# EAGLE schematic Memory (EAGLE 9.6.2)
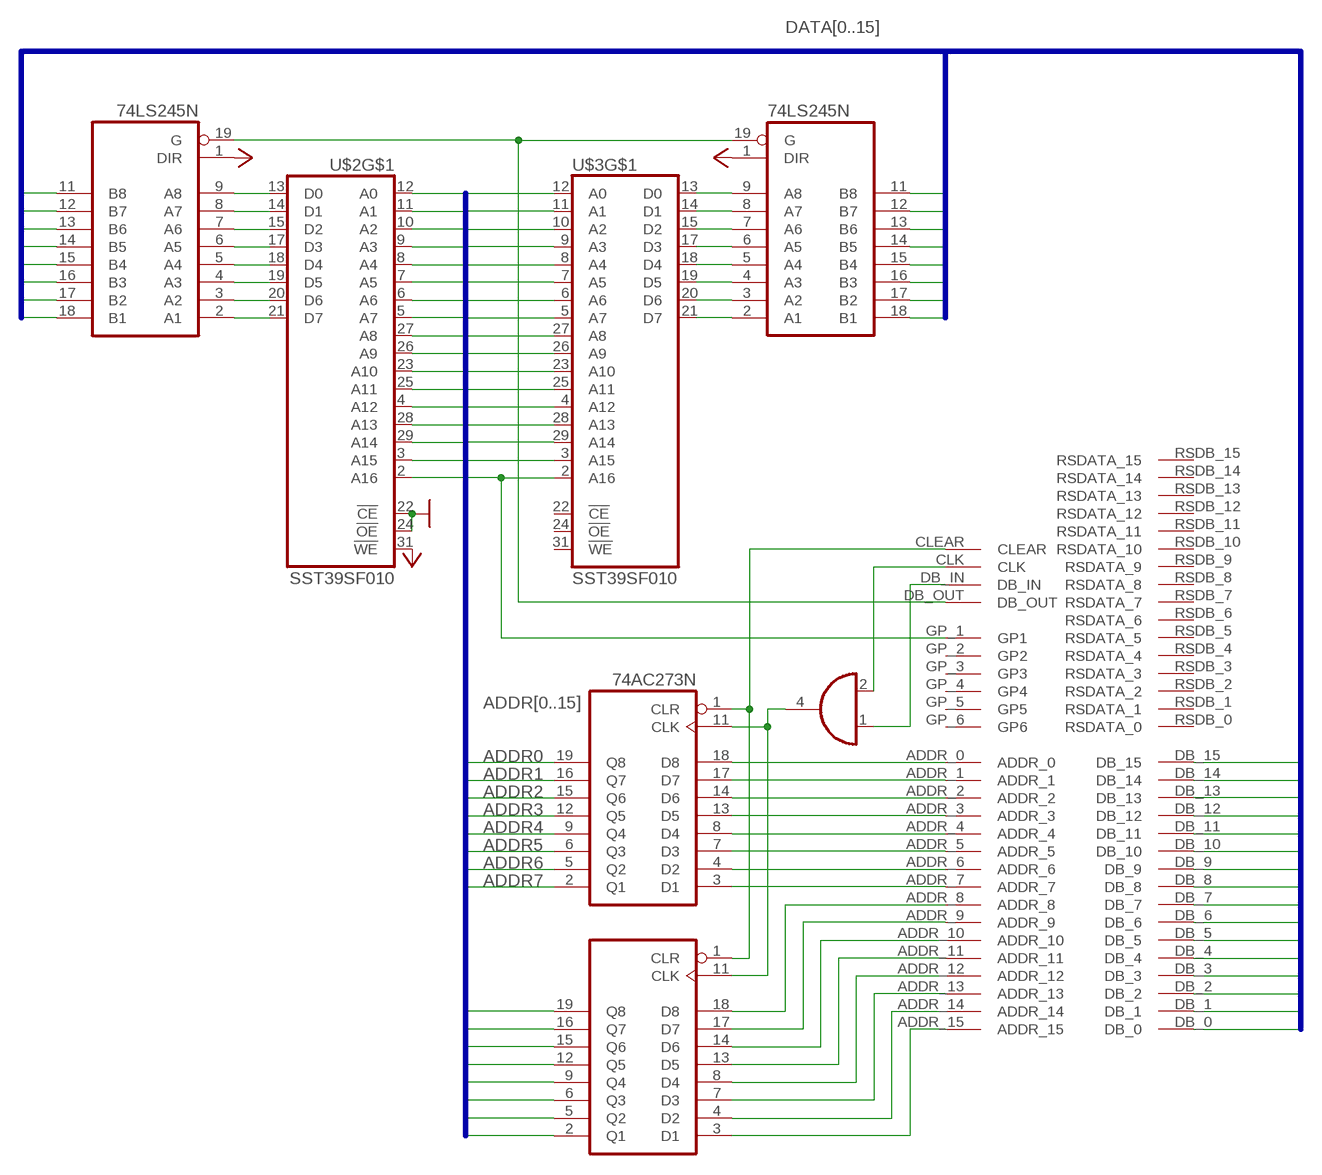
[diagram p0: schematic, sheet 1]

## Parts
IC1  74AC273N  [DIL20]
IC2  74AC273N  [DIL20]
IC4  74AHC1G08DCK  [SC70-5]
OUTPUT_BUFFER_MEMORY  74LS245N  [DIL20]
OUTPUT_BUFFER_MEMORY1  74LS245N  [DIL20]
U$1  BACKPLATE_INTERFACE  [BACK_INTERFACE-FOOT]
U$2  SST39SF010  [DIP32-WIDE]
U$3  SST39SF010  [DIP32-WIDE]

## Nets
ADDR0: IC1.19(Q8) U$2.12(A0) U$3.12(A0)
ADDR1: IC1.16(Q7) U$2.11(A1) U$3.11(A1)
ADDR2: IC1.15(Q6) U$2.10(A2) U$3.10(A2)
ADDR3: IC1.12(Q5) U$2.9(A3) U$3.9(A3)
ADDR4: IC1.9(Q4) U$2.8(A4) U$3.8(A4)
ADDR5: IC1.6(Q3) U$2.7(A5) U$3.7(A5)
ADDR6: IC1.5(Q2) U$2.6(A6) U$3.6(A6)
ADDR7: IC1.2(Q1) U$2.5(A7) U$3.5(A7)
ADDR8: IC2.19(Q8) U$2.27(A8) U$3.27(A8)
ADDR9: IC2.16(Q7) U$2.26(A9) U$3.26(A9)
ADDR10: IC2.15(Q6) U$2.23(A10) U$3.23(A10)
ADDR11: IC2.12(Q5) U$2.25(A11) U$3.25(A11)
ADDR12: IC2.9(Q4) U$2.4(A12) U$3.4(A12)
ADDR13: IC2.6(Q3) U$2.28(A13) U$3.28(A13)
ADDR14: IC2.5(Q2) U$2.3(A15) U$2.29(A14) U$3.29(A14)
ADDR15: IC2.2(Q1) U$3.3(A15)
DATA0: OUTPUT_BUFFER_MEMORY.11(B8) U$1.DB_0
DATA1: OUTPUT_BUFFER_MEMORY.12(B7) U$1.DB_1
DATA2: OUTPUT_BUFFER_MEMORY.13(B6) U$1.DB_2
DATA3: OUTPUT_BUFFER_MEMORY.14(B5) U$1.DB_3
DATA4: OUTPUT_BUFFER_MEMORY.15(B4) U$1.DB_4
DATA5: OUTPUT_BUFFER_MEMORY.16(B3) U$1.DB_5
DATA6: OUTPUT_BUFFER_MEMORY.17(B2) U$1.DB_6
DATA7: OUTPUT_BUFFER_MEMORY.18(B1) U$1.DB_7
DATA8: OUTPUT_BUFFER_MEMORY1.11(B8) U$1.DB_8
DATA9: OUTPUT_BUFFER_MEMORY1.12(B7) U$1.DB_9
DATA10: OUTPUT_BUFFER_MEMORY1.13(B6) U$1.DB_10
DATA11: OUTPUT_BUFFER_MEMORY1.14(B5) U$1.DB_11
DATA12: OUTPUT_BUFFER_MEMORY1.15(B4) U$1.DB_12
DATA13: OUTPUT_BUFFER_MEMORY1.16(B3) U$1.DB_13
DATA14: OUTPUT_BUFFER_MEMORY1.17(B2) U$1.DB_14
DATA15: OUTPUT_BUFFER_MEMORY1.18(B1) U$1.DB_15
GND: U$2.22(!CE) U$2.24(!OE)
N$1: IC1.18(D8) U$1.ADDR_0
N$2: IC1.17(D7) U$1.ADDR_1
N$3: IC1.14(D6) U$1.ADDR_2
N$4: IC1.13(D5) U$1.ADDR_3
N$5: IC1.8(D4) U$1.ADDR_4
N$6: IC1.7(D3) U$1.ADDR_5
N$7: IC1.4(D2) U$1.ADDR_6
N$8: IC1.3(D1) U$1.ADDR_7
N$9: IC2.18(D8) U$1.ADDR_8
N$10: IC2.17(D7) U$1.ADDR_9
N$11: IC2.14(D6) U$1.ADDR_10
N$12: IC2.13(D5) U$1.ADDR_11
N$13: IC2.8(D4) U$1.ADDR_12
N$14: IC2.7(D3) U$1.ADDR_13
N$15: IC2.4(D2) U$1.ADDR_14
N$16: IC2.3(D1) U$1.ADDR_15
N$17: U$1.GP_1(GP1) U$2.2(A16) U$3.2(A16)
N$18: IC1.1(CLR) IC2.1(CLR) U$1.CLEAR
N$19: IC1.11(CLK) IC2.11(CLK) IC4.4(O)
N$20: OUTPUT_BUFFER_MEMORY1.19(G) OUTPUT_BUFFER_MEMORY.19(G) U$1.DB_OUT
N$21: IC4.1(I0) U$1.DB_IN
N$22: IC4.2(I1) U$1.CLK
N$23: OUTPUT_BUFFER_MEMORY.2(A1) U$2.21(D7)
N$24: OUTPUT_BUFFER_MEMORY.3(A2) U$2.20(D6)
N$25: OUTPUT_BUFFER_MEMORY.4(A3) U$2.19(D5)
N$26: OUTPUT_BUFFER_MEMORY.5(A4) U$2.18(D4)
N$27: OUTPUT_BUFFER_MEMORY.6(A5) U$2.17(D3)
N$28: OUTPUT_BUFFER_MEMORY.7(A6) U$2.15(D2)
N$29: OUTPUT_BUFFER_MEMORY.8(A7) U$2.14(D1)
N$30: OUTPUT_BUFFER_MEMORY.9(A8) U$2.13(D0)
N$31: OUTPUT_BUFFER_MEMORY1.2(A1) U$3.21(D7)
N$32: OUTPUT_BUFFER_MEMORY1.3(A2) U$3.20(D6)
N$33: OUTPUT_BUFFER_MEMORY1.4(A3) U$3.19(D5)
N$34: OUTPUT_BUFFER_MEMORY1.5(A4) U$3.18(D4)
N$35: OUTPUT_BUFFER_MEMORY1.6(A5) U$3.17(D3)
N$36: OUTPUT_BUFFER_MEMORY1.7(A6) U$3.15(D2)
N$37: OUTPUT_BUFFER_MEMORY1.8(A7) U$3.14(D1)
N$38: OUTPUT_BUFFER_MEMORY1.9(A8) U$3.13(D0)
VCC: OUTPUT_BUFFER_MEMORY1.1(DIR) OUTPUT_BUFFER_MEMORY.1(DIR) U$2.31(!WE)
Unconnected: U$1.GP_2(GP2) U$1.GP_3(GP3) U$1.GP_4(GP4) U$1.GP_5(GP5) U$1.GP_6(GP6) U$1.NC_0 U$1.NC_1 U$1.RSDB_0(RSDATA_0) U$1.RSDB_1(RSDATA_1) U$1.RSDB_2(RSDATA_2) U$1.RSDB_3(RSDATA_3) U$1.RSDB_4(RSDATA_4) U$1.RSDB_5(RSDATA_5) U$1.RSDB_6(RSDATA_6) U$1.RSDB_7(RSDATA_7) U$1.RSDB_8(RSDATA_8) U$1.RSDB_9(RSDATA_9) U$1.RSDB_10(RSDATA_10) U$1.RSDB_11(RSDATA_11) U$1.RSDB_12(RSDATA_12) U$1.RSDB_13(RSDATA_13) U$1.RSDB_14(RSDATA_14) U$1.RSDB_15(RSDATA_15) U$3.22(!CE) U$3.24(!OE) U$3.31(!WE)

## Buses
ADDR[0..15]
DATA[0..15]

## Power pins joined to a net without a drawn wire
GND: IC1.10(GND) IC2.10(GND) IC4.3(GND) OUTPUT_BUFFER_MEMORY1.10(GND) OUTPUT_BUFFER_MEMORY.10(GND) U$1.GND U$1.GND2(GND) U$2.16(GND) U$3.16(GND)
VCC: IC1.20(VCC) IC2.20(VCC) IC4.5(VCC) OUTPUT_BUFFER_MEMORY1.20(VCC) OUTPUT_BUFFER_MEMORY.20(VCC) U$1.VCC U$1.VCC2(VCC) U$2.32(VCC) U$3.32(VCC)

## Library data of the parts
IC1 IC2 = 74xx-eu:74*273: Octal D type FLIP FLOP, clear
IC4 = 74xx-little-de:74*1G08: 2-input AND gate
OUTPUT_BUFFER_MEMORY OUTPUT_BUFFER_MEMORY1 = 74xx-eu:74*245: Octal BUS TRANSCEIVER, 3-state
U$1 = Computer:BACKPLATE_INTERFACE
U$2 U$3 = Computer:SST39SF010